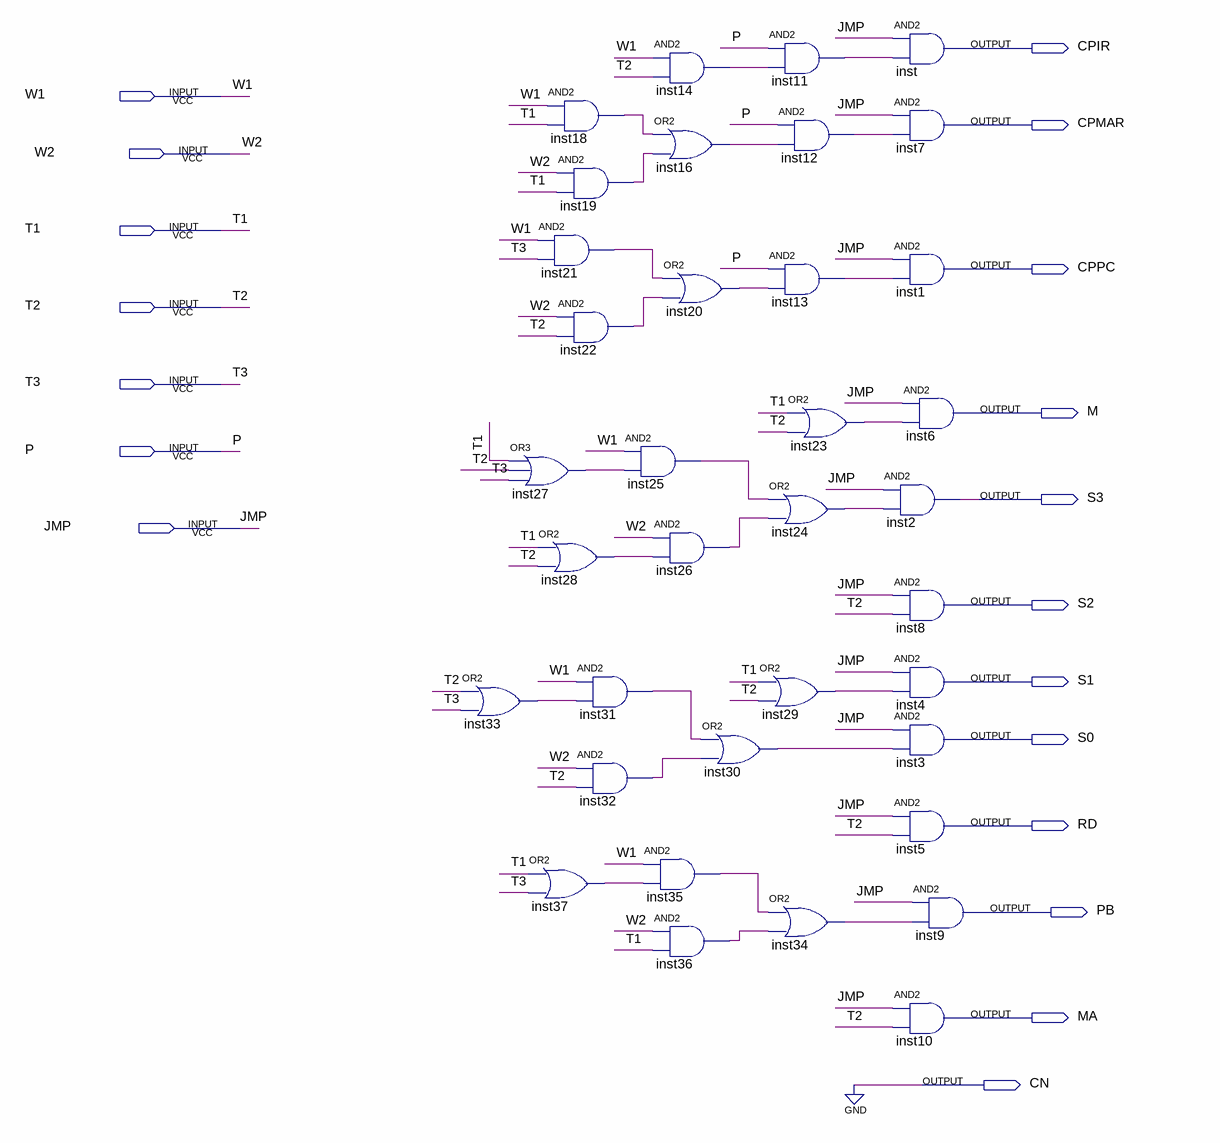
[diagram p0: schematic sheet]
// Quartus schematic jmp_gene.bdf as structural Verilog: 36 symbols, 19 pins
module jmp_gene (
  input  W1,
  input  W2,
  input  T1,
  input  T2,
  input  T3,
  input  P,
  input  JMP,
  output CPIR,
  output CPMAR,
  output CPPC,
  output M,
  output S3,
  output S2,
  output S1,
  output S0,
  output RD,
  output PB,
  output MA,
  output CN
);

  wire inst11_out, inst12_out, inst13_out, inst14_out, inst16_out, inst18_out, inst19_out, inst20_out,
       inst21_out, inst22_out, inst23_out, inst24_out, inst25_out, inst26_out, inst27_out, inst28_out,
       inst29_out, inst30_out, inst31_out, inst32_out, inst33_out, inst34_out, inst35_out, inst36_out,
       inst37_out;

  or inst33 (inst33_out, T2, T3);
  and inst21 (inst21_out, W1, T3);
  or inst27 (inst27_out, T1, T2, T3);
  or inst28 (inst28_out, T1, T2);
  or inst37 (inst37_out, T1, T3);
  and inst18 (inst18_out, W1, T1);
  and inst19 (inst19_out, W2, T1);
  and inst22 (inst22_out, W2, T2);
  and inst31 (inst31_out, W1, inst33_out);
  and inst32 (inst32_out, W2, T2);
  and inst14 (inst14_out, W1, T2);
  or inst16 (inst16_out, inst18_out, inst19_out);
  or inst20 (inst20_out, inst21_out, inst22_out);
  and inst25 (inst25_out, W1, inst27_out);
  and inst26 (inst26_out, W2, inst28_out);
  and inst35 (inst35_out, W1, inst37_out);
  and inst36 (inst36_out, W2, T1);
  and inst11 (inst11_out, P, inst14_out);
  and inst13 (inst13_out, P, inst20_out);
  or inst24 (inst24_out, inst25_out, inst26_out);
  or inst29 (inst29_out, T1, T2);
  or inst30 (inst30_out, inst31_out, inst32_out);
  or inst34 (inst34_out, inst35_out, inst36_out);
  and inst12 (inst12_out, P, inst16_out);
  or inst23 (inst23_out, T1, T2);
  and inst (CPIR, JMP, inst11_out);
  and inst7 (CPMAR, JMP, inst12_out);
  and inst1 (CPPC, JMP, inst13_out);
  and inst6 (M, JMP, inst23_out);
  and inst2 (S3, JMP, inst24_out);
  and inst8 (S2, JMP, T2);
  and inst4 (S1, JMP, inst29_out);
  and inst3 (S0, JMP, inst30_out);
  and inst5 (RD, JMP, T2);
  and inst9 (PB, JMP, inst34_out);
  and inst10 (MA, JMP, T2);

  assign CN = 1'b0;
endmodule
